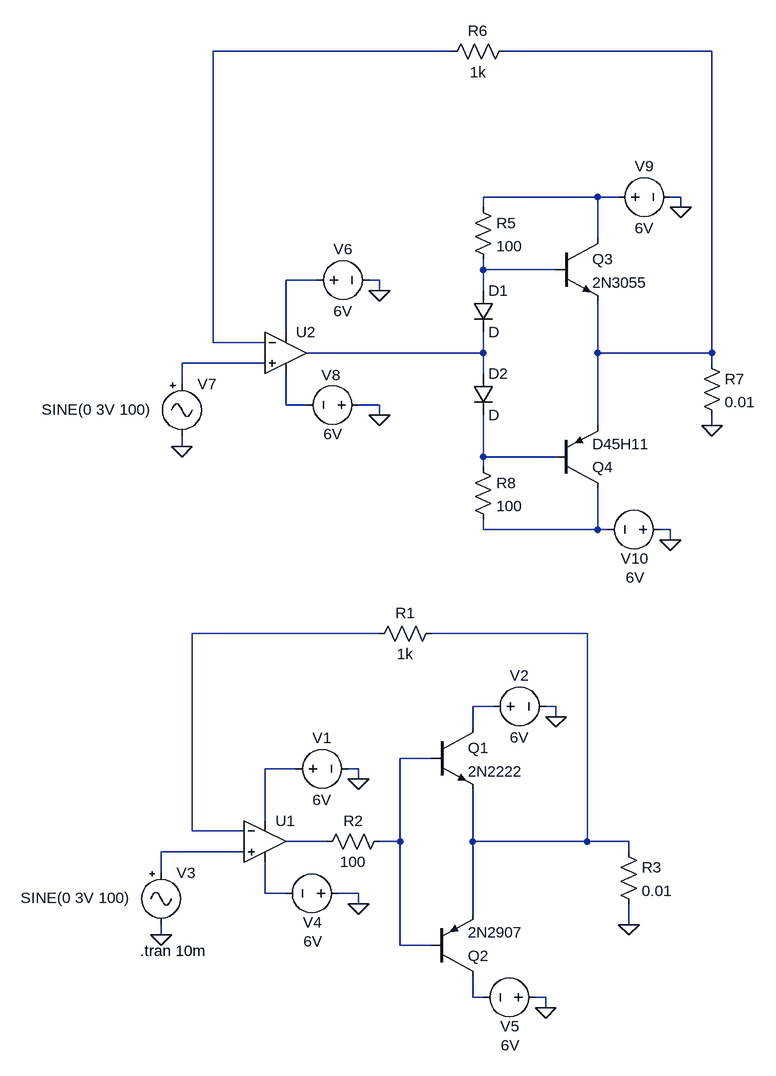
[diagram p0: schematic V2_Stage.asc]
V2_Stage.asc, the LTspice schematic file:
Version 4
SHEET 1 1464 680
WIRE 464 -1024 96 -1024
WIRE 864 -1024 544 -1024
WIRE 688 -800 512 -800
WIRE 720 -800 688 -800
WIRE 816 -800 800 -800
WIRE 512 -784 512 -800
WIRE 816 -784 816 -800
WIRE 688 -736 688 -800
WIRE 512 -688 512 -704
WIRE 624 -688 512 -688
WIRE 256 -672 208 -672
WIRE 352 -672 336 -672
WIRE 352 -656 352 -672
WIRE 512 -656 512 -688
WIRE 208 -592 208 -672
WIRE 96 -576 96 -1024
WIRE 176 -576 96 -576
WIRE 512 -560 512 -592
WIRE 512 -560 240 -560
WIRE 688 -560 688 -640
WIRE 864 -560 864 -1024
WIRE 864 -560 688 -560
WIRE 176 -544 48 -544
WIRE 864 -544 864 -560
WIRE 512 -528 512 -560
WIRE 48 -512 48 -544
WIRE 208 -480 208 -528
WIRE 240 -480 208 -480
WIRE 352 -480 320 -480
WIRE 352 -464 352 -480
WIRE 688 -448 688 -560
WIRE 864 -448 864 -464
WIRE 48 -416 48 -432
WIRE 512 -400 512 -464
WIRE 624 -400 512 -400
WIRE 512 -384 512 -400
WIRE 512 -288 512 -304
WIRE 688 -288 688 -352
WIRE 688 -288 512 -288
WIRE 704 -288 688 -288
WIRE 800 -288 784 -288
WIRE 800 -272 800 -288
WIRE 352 -128 64 -128
WIRE 672 -128 432 -128
WIRE 528 -16 496 -16
WIRE 624 -16 608 -16
WIRE 624 0 624 -16
WIRE 496 16 496 -16
WIRE 432 64 384 64
WIRE 224 80 176 80
WIRE 320 80 304 80
WIRE 320 96 320 80
WIRE 176 160 176 80
WIRE 64 176 64 -128
WIRE 144 176 64 176
WIRE 272 192 208 192
WIRE 384 192 384 64
WIRE 384 192 352 192
WIRE 496 192 496 112
WIRE 672 192 672 -128
WIRE 672 192 496 192
WIRE 736 192 672 192
WIRE 144 208 16 208
WIRE 736 208 736 192
WIRE 16 240 16 208
WIRE 176 272 176 224
WIRE 208 272 176 272
WIRE 320 272 288 272
WIRE 320 288 320 272
WIRE 496 304 496 192
WIRE 736 320 736 288
WIRE 16 336 16 320
WIRE 384 352 384 192
WIRE 432 352 384 352
WIRE 496 432 496 400
WIRE 512 432 496 432
WIRE 608 432 592 432
WIRE 608 448 608 432
FLAG 320 96 0
FLAG 16 336 0
FLAG 320 288 0
FLAG 624 0 0
FLAG 608 448 0
FLAG 736 320 0
FLAG 352 -656 0
FLAG 48 -416 0
FLAG 352 -464 0
FLAG 816 -784 0
FLAG 800 -272 0
FLAG 864 -448 0
SYMBOL voltage 208 80 R270
WINDOW 0 32 56 VTop 2
WINDOW 3 -32 56 VBottom 2
SYMATTR InstName V1
SYMATTR Value 6V
SYMBOL npn 432 16 R0
SYMATTR InstName Q1
SYMATTR Value 2N2222
SYMBOL pnp 432 400 M180
SYMATTR InstName Q2
SYMATTR Value 2N2907
SYMBOL res 368 176 R90
WINDOW 0 0 56 VBottom 2
WINDOW 3 32 56 VTop 2
SYMATTR InstName R2
SYMATTR Value 100
SYMBOL Misc\\signal 16 224 R0
WINDOW 3 -216 55 Left 2
WINDOW 123 0 0 Left 0
WINDOW 39 0 0 Left 0
SYMATTR InstName V3
SYMATTR Value SINE(0 3V 100)
SYMBOL voltage 304 272 R90
WINDOW 0 60 55 VBottom 2
WINDOW 3 58 54 VTop 2
SYMATTR InstName V4
SYMATTR Value 6V
SYMBOL Opamps\\UniversalOpAmp 176 192 R0
SYMATTR InstName U1
SYMBOL voltage 512 -16 R270
WINDOW 0 32 56 VTop 2
WINDOW 3 -32 56 VBottom 2
SYMATTR InstName V2
SYMATTR Value 6V
SYMBOL voltage 608 432 R90
WINDOW 0 60 55 VBottom 2
WINDOW 3 58 54 VTop 2
SYMATTR InstName V5
SYMATTR Value 6V
SYMBOL res 448 -144 R90
WINDOW 0 0 56 VBottom 2
WINDOW 3 32 56 VTop 2
SYMATTR InstName R1
SYMATTR Value 1k
SYMBOL res 720 192 R0
SYMATTR InstName R3
SYMATTR Value 0.01
SYMBOL voltage 240 -672 R270
WINDOW 0 32 56 VTop 2
WINDOW 3 -32 56 VBottom 2
SYMATTR InstName V6
SYMATTR Value 6V
SYMBOL npn 624 -736 R0
SYMATTR InstName Q3
SYMATTR Value 2N3055
SYMBOL pnp 624 -352 M180
SYMATTR InstName Q4
SYMATTR Value D45H11
SYMBOL Misc\\signal 48 -528 R0
WINDOW 3 -216 55 Left 2
WINDOW 123 0 0 Left 0
WINDOW 39 0 0 Left 0
SYMATTR InstName V7
SYMATTR Value SINE(0 3V 100)
SYMBOL voltage 336 -480 R90
WINDOW 0 -30 58 VBottom 2
WINDOW 3 29 55 VTop 2
SYMATTR InstName V8
SYMATTR Value 6V
SYMBOL Opamps\\UniversalOpAmp 208 -560 R0
SYMATTR InstName U2
SYMBOL voltage 704 -800 R270
WINDOW 0 32 56 VTop 2
WINDOW 3 -32 56 VBottom 2
SYMATTR InstName V9
SYMATTR Value 6V
SYMBOL voltage 800 -288 R90
WINDOW 0 60 55 VBottom 2
WINDOW 3 58 54 VTop 2
SYMATTR InstName V10
SYMATTR Value 6V
SYMBOL res 560 -1040 R90
WINDOW 0 0 56 VBottom 2
WINDOW 3 32 56 VTop 2
SYMATTR InstName R6
SYMATTR Value 1k
SYMBOL diode 496 -656 R0
SYMATTR InstName D1
SYMBOL diode 496 -528 R0
SYMATTR InstName D2
SYMBOL res 496 -800 R0
SYMATTR InstName R5
SYMATTR Value 100
SYMBOL res 496 -400 R0
SYMATTR InstName R8
SYMATTR Value 100
SYMBOL res 848 -560 R0
SYMATTR InstName R7
SYMATTR Value 0.01
TEXT -16 360 Left 2 !.tran 10m

The netlist it stands for:
* V2_Stage.asc
V1 N015 0 6V
Q1 N013 N014 N012 0 2N2222
Q2 N019 N014 N012 0 2N2907
R2 N014 N016 100
V3 N017 0 SINE(0 3V 100)
V4 0 N018 6V
XU1 N017 N011 N015 N018 N016 level1 Avol=1Meg GBW=10Meg Vos=0 En=0 Enk=0 In=0 Ink=0 Rin=500Meg  ; pins In+ In- V+ V- OUT
V2 N013 0 6V
V5 0 N019 6V
R1 N012 N011 1k
R3 N012 0 0.01
V6 N005 0 6V
Q3 N003 N004 N002 0 2N3055
Q4 N010 N009 N002 0 D45H11
V7 N007 0 SINE(0 3V 100)
V8 0 N008 6V
XU2 N007 N001 N005 N008 N006 level1 Avol=1Meg GBW=10Meg Vos=0 En=0 Enk=0 In=0 Ink=0 Rin=500Meg  ; pins In+ In- V+ V- OUT
V9 N003 0 6V
V10 0 N010 6V
R6 N002 N001 1k
D1 N004 N006 D
D2 N006 N009 D
R5 N003 N004 100
R8 N009 N010 100
R7 N002 0 0.01
.model D D
.lib standard.dio
.model NPN NPN
.model PNP PNP
.lib standard.bjt
.tran 10m
.lib UniversalOpAmp1.lib
.backanno
.end